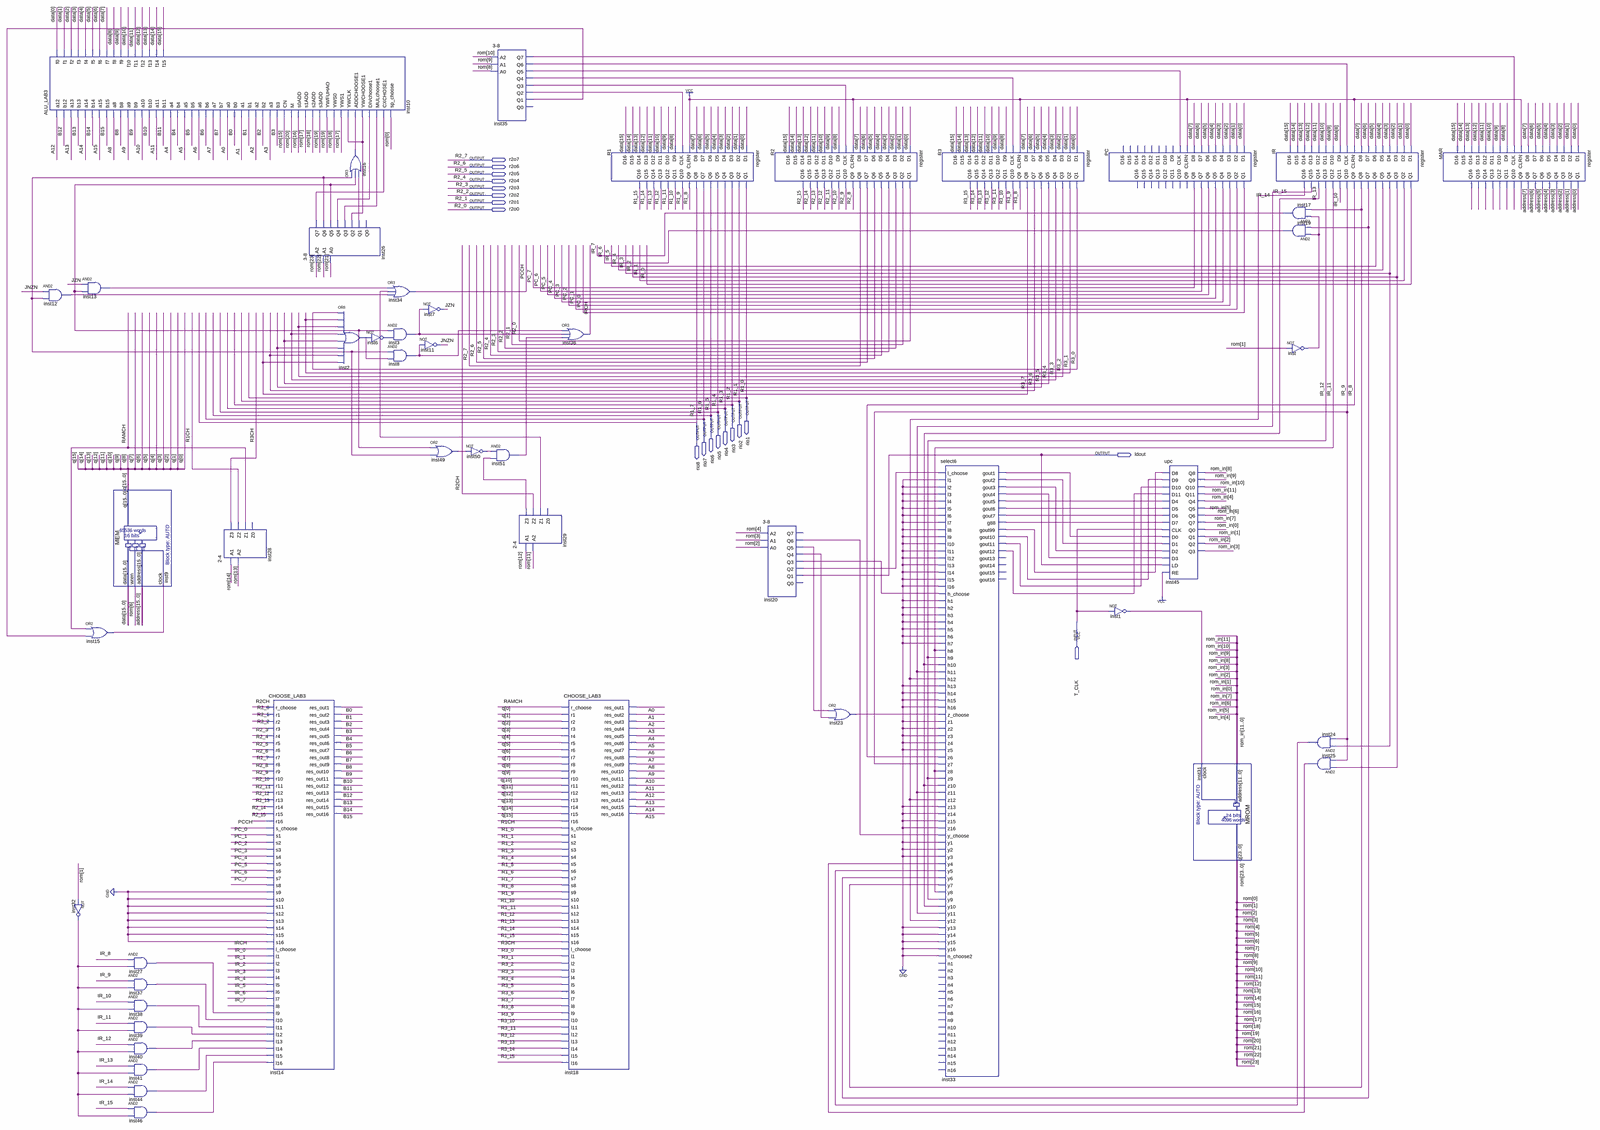
[diagram p0: schematic sheet, whole]
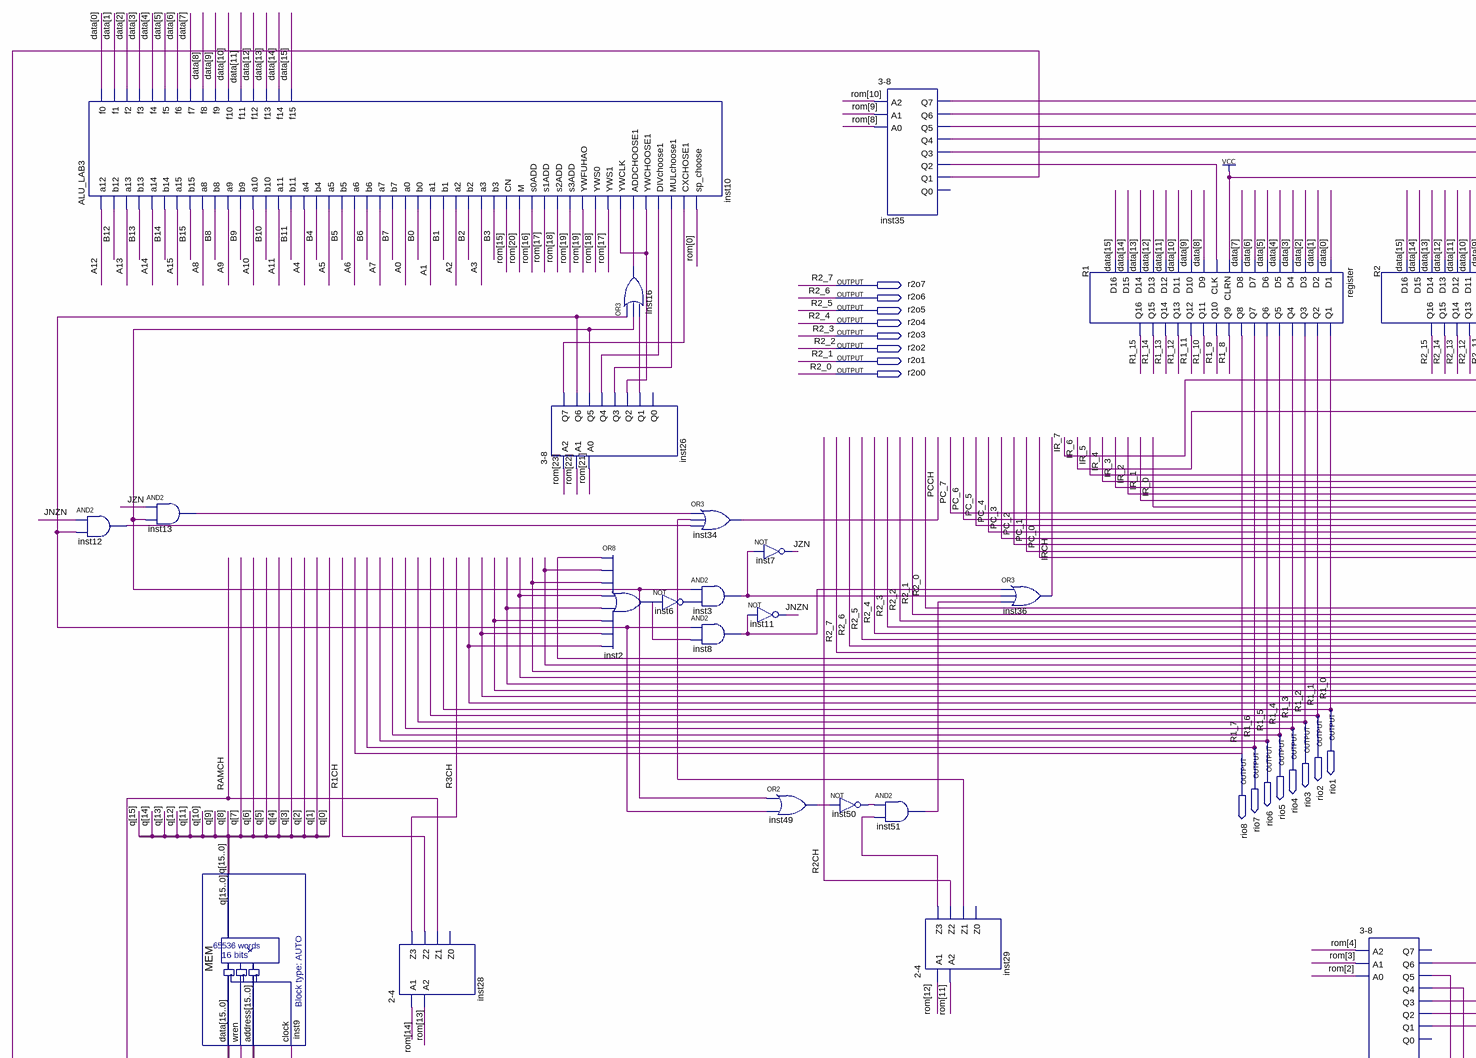
[diagram p1: schematic sheet, upper left part]
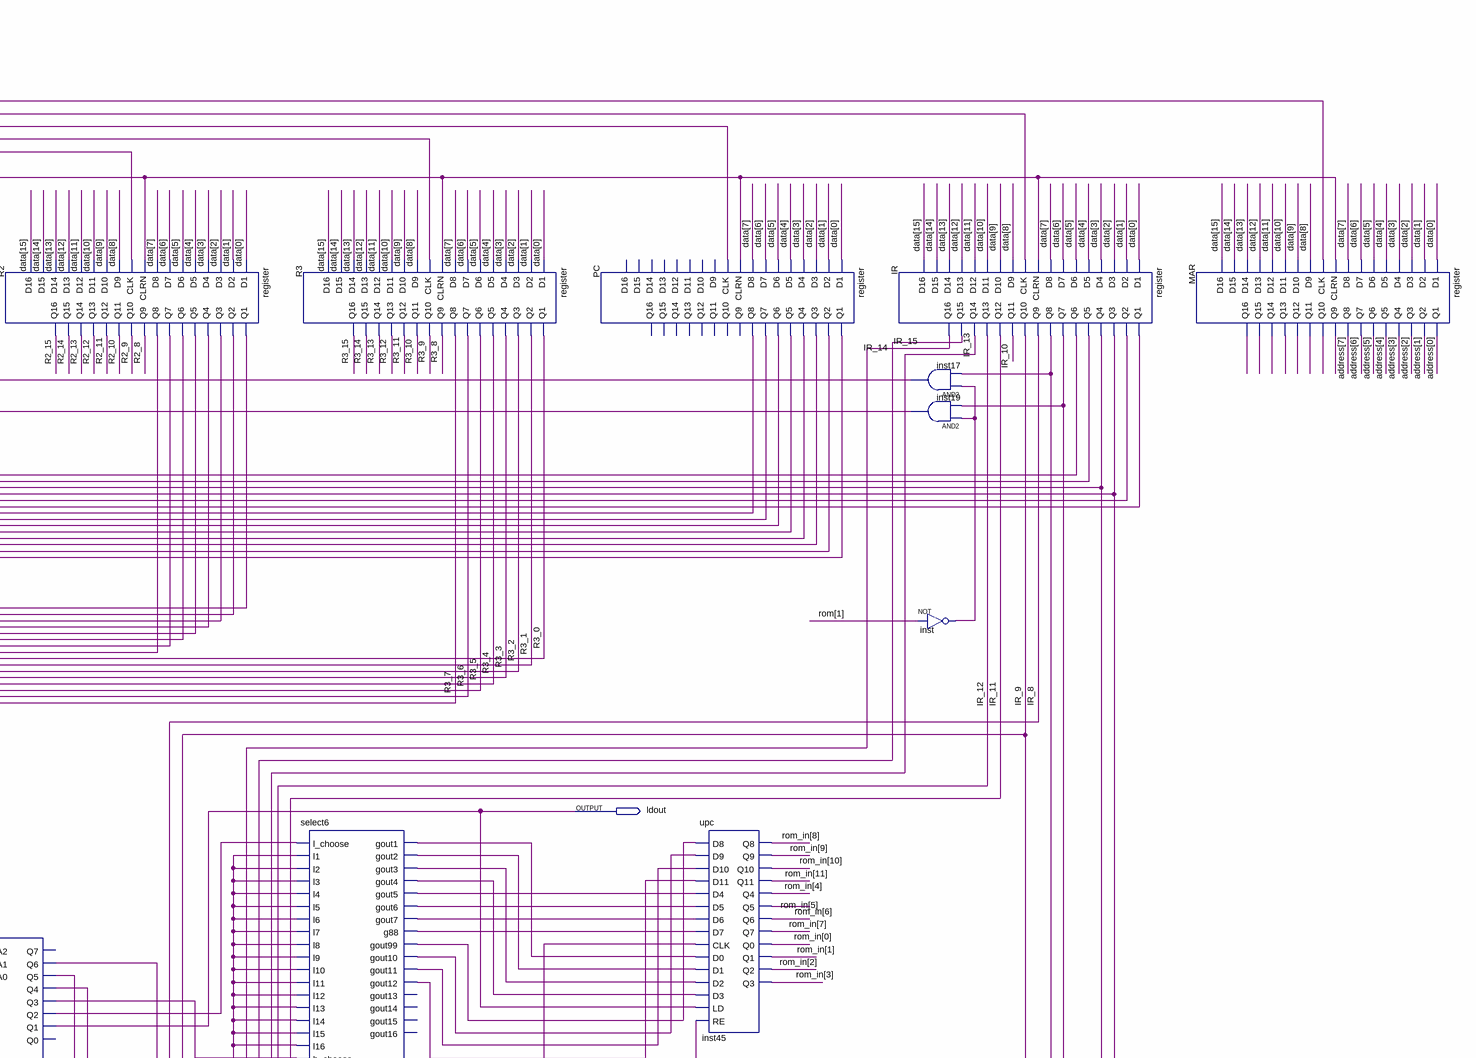
[diagram p2: schematic sheet, upper right part]
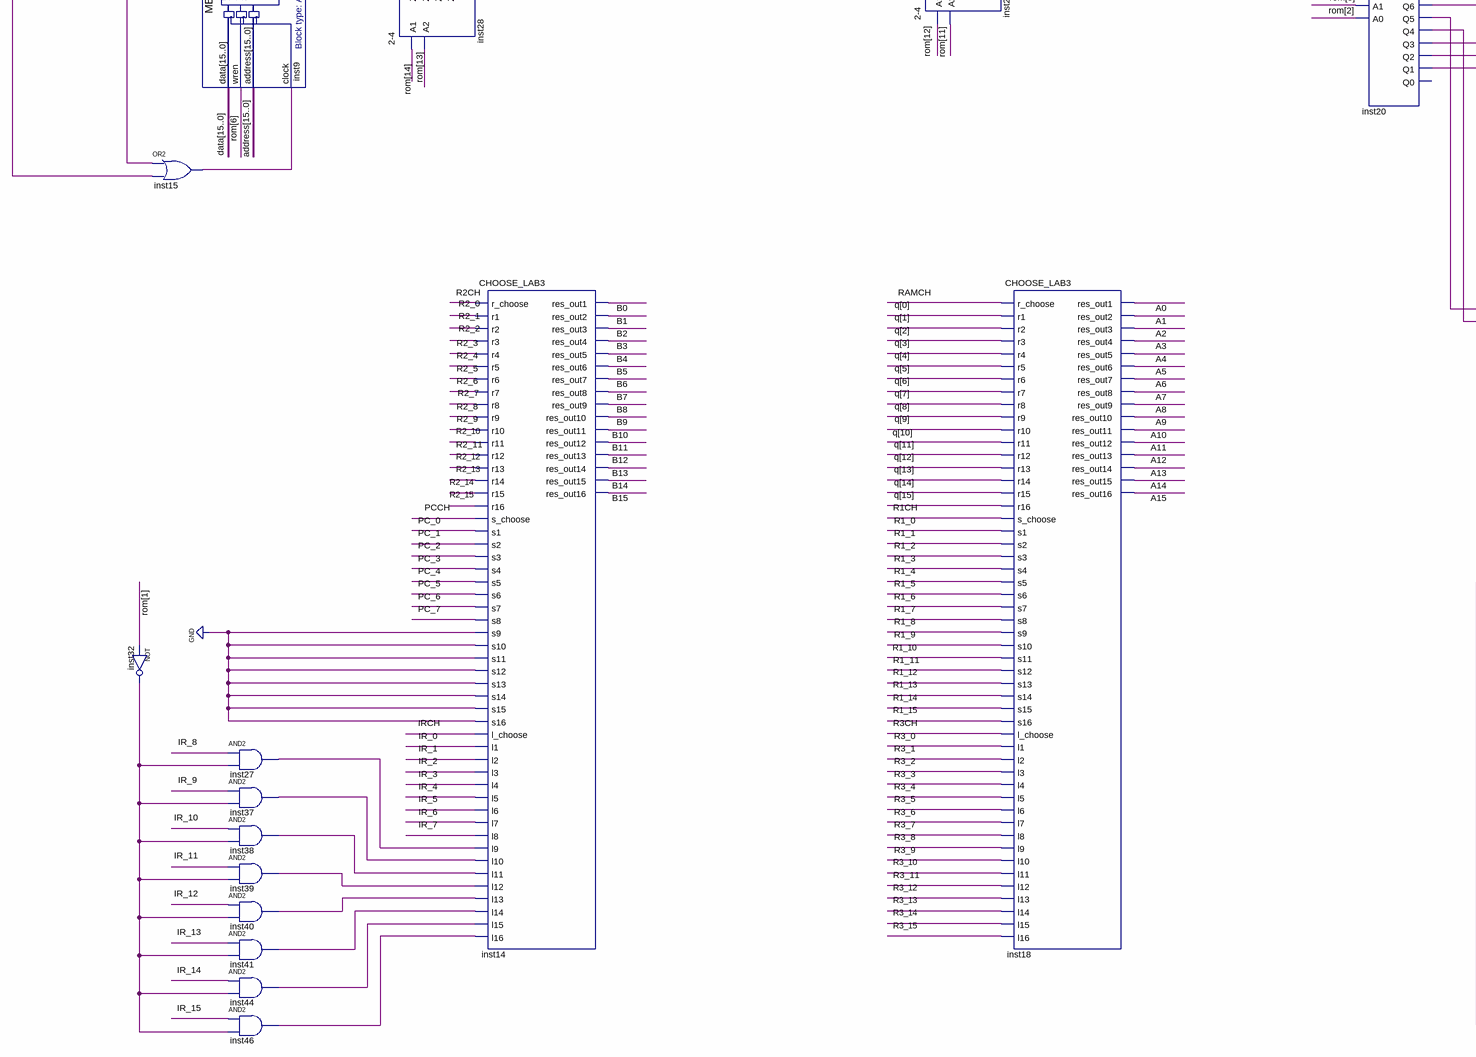
[diagram p3: schematic sheet, lower left part]
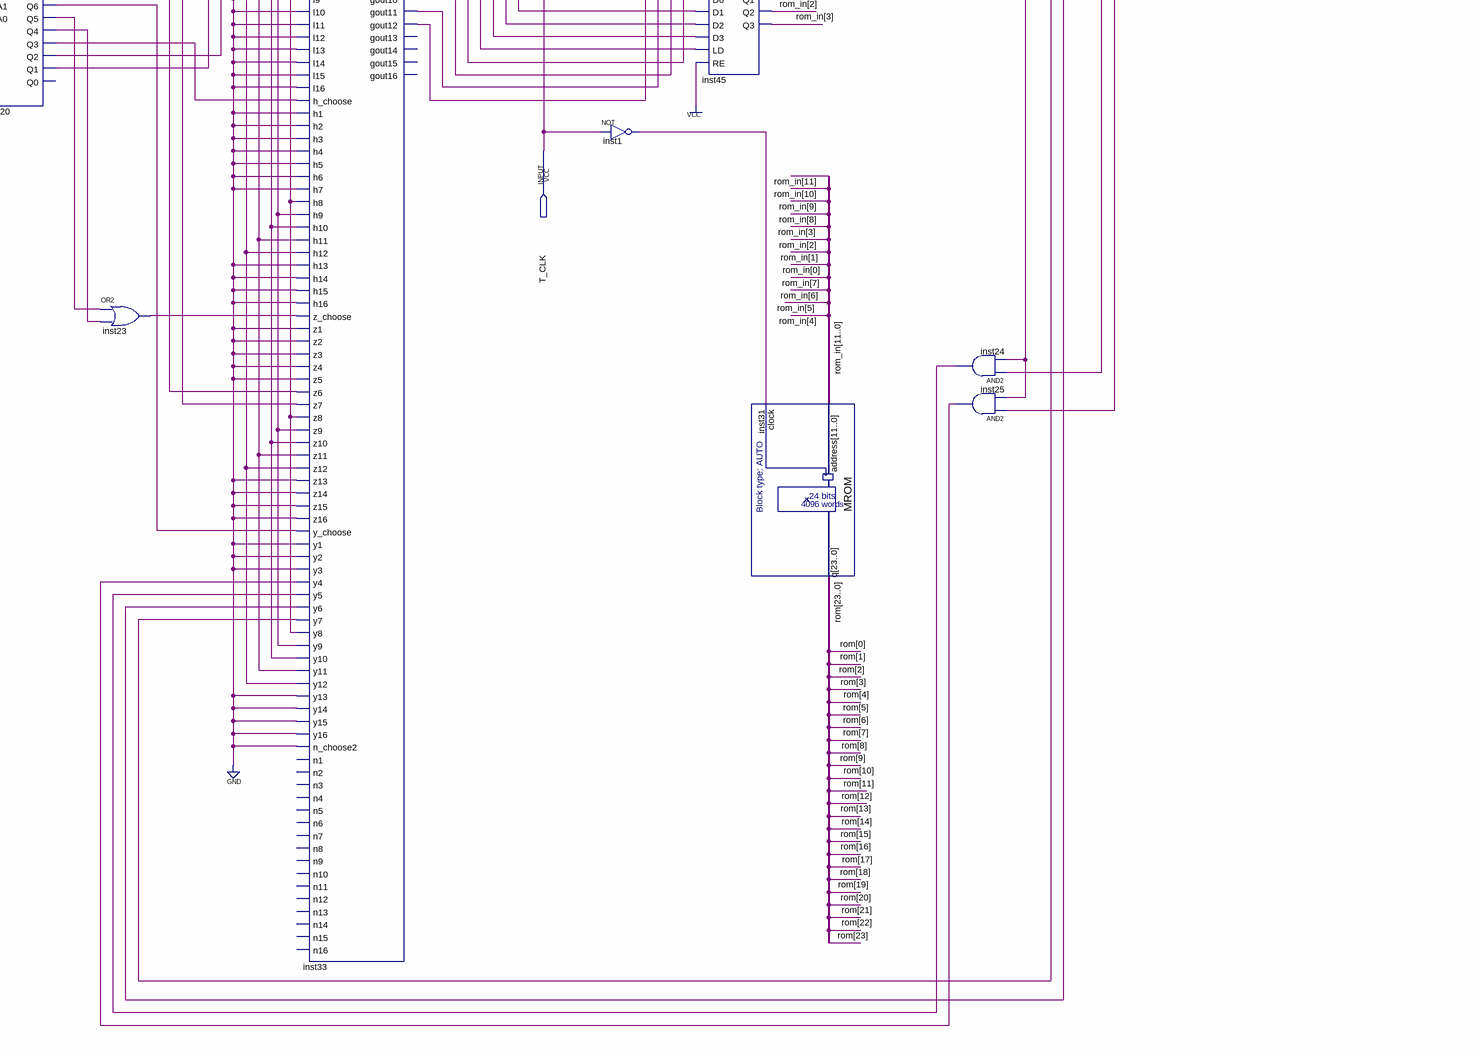
[diagram p4: schematic sheet, lower right part]
// Quartus schematic lab31119.bdf as structural Verilog: 49 symbols, 18 pins
module lab31119 (
  input  T_CLK,
  output r2o7,
  output r2o6,
  output r2o5,
  output r2o4,
  output r2o3,
  output r2o2,
  output r2o1,
  output r2o0,
  output rio1,
  output rio2,
  output rio3,
  output rio4,
  output rio5,
  output rio6,
  output rio7,
  output rio8,
  output ldout
);

  wire A0, A1, A2, A3, A4, A5, A6, A7, A8, A9, A10, A11, A12, A13, A14, A15, B0, B1, B2, B3, B4, B5, B6, B7,
       B8, B9, B10, B11, B12, B13, B14, B15, inst1_out, inst2_out, inst3_out, inst6_out, inst8_out,
       inst12_out, inst13_out, inst15_out, inst16_out, inst20_q2, inst20_q3, inst20_q4, inst20_q5, inst20_q6,
       inst23_out, inst24_out, inst25_out, inst26_q1, inst26_q2, inst26_q3, inst26_q4, inst26_q5, inst26_q6,
       inst26_q7, inst27_out, inst29_z1, inst29_z3, inst32_out, inst33_g88, inst33_gout1, inst33_gout2,
       inst33_gout3, inst33_gout4, inst33_gout5, inst33_gout6, inst33_gout7, inst33_gout10, inst33_gout11,
       inst33_gout12, inst33_gout99, inst35_q1, inst35_q2, inst35_q3, inst35_q4, inst35_q5, inst35_q6,
       inst35_q7, inst37_out, inst38_out, inst39_out, inst40_out, inst41_out, inst44_out, inst46_out,
       inst49_out, inst50_out, inst51_out, inst_out, IR_0, IR_1, IR_2, IR_3, IR_4, IR_5, IR_6, IR_7, IR_8,
       IR_9, IR_10, IR_11, IR_12, IR_13, IR_14, IR_15, IR_q7, IR_q8, IRCH, JNZN, JZN, MAR_q9, MAR_q10,
       MAR_q11, MAR_q12, MAR_q13, MAR_q14, MAR_q15, MAR_q16, PC_0, PC_1, PC_2, PC_3, PC_4, PC_5, PC_6, PC_7,
       PCCH, R1_8, R1_9, R1_10, R1_11, R1_12, R1_13, R1_14, R1_15, R1CH, R2_8, R2_9, R2_10, R2_11, R2_12,
       R2_13, R2_14, R2_15, R2CH, R3_0, R3_1, R3_2, R3_3, R3_4, R3_5, R3_6, R3_7, R3_8, R3_9, R3_10, R3_11,
       R3_12, R3_13, R3_14, R3_15, R3CH, RAMCH;
  wire [11:0] rom_in;
  wire [15:0] address, data, q;
  wire [23:0] rom;

  ALU_LAB3 inst10 (
    .a12(A12), .b12(B12), .a13(A13), .b13(B13), .a14(A14), .b14(B14), .a15(A15), .b15(B15), .a8(A8), .b8(B8),
    .a9(A9), .b9(B9), .a10(A10), .b10(B10), .a11(A11), .b11(B11), .a4(A4), .b4(B4), .a5(A5), .b5(B5),
    .a6(A6), .b6(B6), .a7(A7), .b7(B7), .a0(A0), .b0(B0), .a1(A1), .b1(B1), .a2(A2), .b2(B2), .a3(A3),
    .b3(B3), .CN(rom[15]), .M(rom[20]), .s0ADD(rom[16]), .s1ADD(rom[17]), .s2ADD(rom[18]), .s3ADD(rom[19]),
    .YWFUHAO(rom[19]), .YWS0(rom[18]), .YWS1(rom[17]), .YWCLK(inst26_q2), .ADDCHOOSE1(inst16_out),
    .YWCHOOSE1(inst26_q2), .DIVchoose1(inst26_q4), .MULchoose1(inst26_q3), .CXCHOSE1(inst26_q7),
    .sp_choose(rom[0]), .f0(data[0]), .f1(data[1]), .f2(data[2]), .f3(data[3]), .f4(data[4]), .f5(data[5]),
    .f6(data[6]), .f7(data[7]), .f8(data[8]), .f9(data[9]), .f10(data[10]), .f11(data[11]), .f12(data[12]),
    .f13(data[13]), .f14(data[14]), .f15(data[15]));
  and inst12 (inst12_out, JNZN, inst26_q6);
  not inst32 (inst32_out, rom[1]);
  and inst13 (inst13_out, JZN, inst26_q5);
  or inst15 (inst15_out, RAMCH, inst35_q1);
  MEM inst9 (.data(data), .wren(rom[6]), .address(address), .clock(inst15_out), .q(q));
  and inst27 (inst27_out, IR_8, inst32_out);
  and inst37 (inst37_out, IR_9, inst32_out);
  and inst38 (inst38_out, IR_10, inst32_out);
  and inst39 (inst39_out, IR_11, inst32_out);
  and inst40 (inst40_out, IR_12, inst32_out);
  and inst41 (inst41_out, IR_13, inst32_out);
  and inst44 (inst44_out, IR_14, inst32_out);
  and inst46 (inst46_out, IR_15, inst32_out);
  \2-4  inst28 (.A1(rom[14]), .A2(rom[13]), .Z3(R3CH), .Z2(R1CH), .Z1(RAMCH));  // open: Z0
  CHOOSE_LAB3 inst14 (
    .r_choose(R2CH), .r1(r2o0), .r2(r2o1), .r3(r2o2), .r4(r2o3), .r5(r2o4), .r6(r2o5), .r7(r2o6), .r8(r2o7),
    .r9(R2_8), .r10(R2_9), .r11(R2_10), .r12(R2_11), .r13(R2_12), .r14(R2_13), .r15(R2_14), .r16(R2_15),
    .s_choose(PCCH), .s1(PC_0), .s2(PC_1), .s3(PC_2), .s4(PC_3), .s5(PC_4), .s6(PC_5), .s7(PC_6), .s8(PC_7),
    .s9(1'b0), .s10(1'b0), .s11(1'b0), .s12(1'b0), .s13(1'b0), .s14(1'b0), .s15(1'b0), .s16(1'b0),
    .l_choose(IRCH), .l1(IR_0), .l2(IR_1), .l3(IR_2), .l4(IR_3), .l5(IR_4), .l6(IR_5), .l7(IR_6), .l8(IR_7),
    .l9(inst27_out), .l10(inst37_out), .l11(inst38_out), .l12(inst39_out), .l13(inst40_out),
    .l14(inst41_out), .l15(inst44_out), .l16(inst46_out), .res_out1(B0), .res_out2(B1), .res_out3(B2),
    .res_out4(B3), .res_out5(B4), .res_out6(B5), .res_out7(B6), .res_out8(B7), .res_out9(B8), .res_out10(B9),
    .res_out11(B10), .res_out12(B11), .res_out13(B12), .res_out14(B13), .res_out15(B14), .res_out16(B15));
  \3-8  inst26 (
    .A2(rom[23]), .A1(rom[22]), .A0(rom[21]), .Q7(inst26_q7), .Q6(inst26_q6), .Q5(inst26_q5), .Q4(inst26_q4),
    .Q3(inst26_q3), .Q2(inst26_q2), .Q1(inst26_q1));  // open: Q0
  or inst16 (inst16_out, inst26_q6, inst26_q5, inst26_q1);
  or inst2 (inst2_out, R3_0, R3_1, R3_2, R3_3, R3_4, R3_5, R3_6, R3_7);
  or inst34 (PCCH, inst13_out, inst29_z1, inst12_out);
  and inst3 (inst3_out, inst26_q5, inst6_out);
  not inst6 (inst6_out, inst2_out);
  and inst8 (inst8_out, inst26_q6, inst2_out);
  not inst7 (JZN, inst3_out);
  not inst11 (JNZN, inst8_out);
  or inst49 (inst49_out, inst26_q5, inst26_q6);
  not inst50 (inst50_out, inst49_out);
  \3-8  inst35 (
    .A2(rom[10]), .A1(rom[9]), .A0(rom[8]), .Q7(inst35_q7), .Q6(inst35_q6), .Q5(inst35_q5), .Q4(inst35_q4),
    .Q3(inst35_q3), .Q2(inst35_q2), .Q1(inst35_q1));  // open: Q0
  and inst51 (inst51_out, inst50_out, inst29_z3);
  \2-4  inst29 (.A1(rom[12]), .A2(rom[11]), .Z3(inst29_z3), .Z2(R2CH), .Z1(inst29_z1));  // open: Z0
  or inst36 (IRCH, inst8_out, inst3_out, inst51_out);
  CHOOSE_LAB3 inst18 (
    .r_choose(RAMCH), .r1(q[0]), .r2(q[1]), .r3(q[2]), .r4(q[3]), .r5(q[4]), .r6(q[5]), .r7(q[6]), .r8(q[7]),
    .r9(q[8]), .r10(q[9]), .r11(q[10]), .r12(q[11]), .r13(q[12]), .r14(q[13]), .r15(q[14]), .r16(q[15]),
    .s_choose(R1CH), .s1(rio1), .s2(rio2), .s3(rio3), .s4(rio4), .s5(rio5), .s6(rio6), .s7(rio7), .s8(rio8),
    .s9(R1_8), .s10(R1_9), .s11(R1_10), .s12(R1_11), .s13(R1_12), .s14(R1_13), .s15(R1_14), .s16(R1_15),
    .l_choose(R3CH), .l1(R3_0), .l2(R3_1), .l3(R3_2), .l4(R3_3), .l5(R3_4), .l6(R3_5), .l7(R3_6), .l8(R3_7),
    .l9(R3_8), .l10(R3_9), .l11(R3_10), .l12(R3_11), .l13(R3_12), .l14(R3_13), .l15(R3_14), .l16(R3_15),
    .res_out1(A0), .res_out2(A1), .res_out3(A2), .res_out4(A3), .res_out5(A4), .res_out6(A5), .res_out7(A6),
    .res_out8(A7), .res_out9(A8), .res_out10(A9), .res_out11(A10), .res_out12(A11), .res_out13(A12),
    .res_out14(A13), .res_out15(A14), .res_out16(A15));
  register R1 (
    .D1(data[0]), .D2(data[1]), .D3(data[2]), .D4(data[3]), .D5(data[4]), .D6(data[5]), .D7(data[6]),
    .D8(data[7]), .CLRN(1'b1), .CLK(inst35_q2), .D9(data[8]), .D10(data[9]), .D11(data[10]), .D12(data[11]),
    .D13(data[12]), .D14(data[13]), .D15(data[14]), .D16(data[15]), .Q1(rio1), .Q2(rio2), .Q3(rio3),
    .Q4(rio4), .Q5(rio5), .Q6(rio6), .Q7(rio7), .Q8(rio8), .Q9(R1_8), .Q10(R1_9), .Q11(R1_10), .Q12(R1_11),
    .Q13(R1_12), .Q14(R1_13), .Q15(R1_14), .Q16(R1_15));
  register R2 (
    .D1(data[0]), .D2(data[1]), .D3(data[2]), .D4(data[3]), .D5(data[4]), .D6(data[5]), .D7(data[6]),
    .D8(data[7]), .CLRN(1'b1), .CLK(inst35_q3), .D9(data[8]), .D10(data[9]), .D11(data[10]), .D12(data[11]),
    .D13(data[12]), .D14(data[13]), .D15(data[14]), .D16(data[15]), .Q1(r2o0), .Q2(r2o1), .Q3(r2o2),
    .Q4(r2o3), .Q5(r2o4), .Q6(r2o5), .Q7(r2o6), .Q8(r2o7), .Q9(R2_8), .Q10(R2_9), .Q11(R2_10), .Q12(R2_11),
    .Q13(R2_12), .Q14(R2_13), .Q15(R2_14), .Q16(R2_15));
  \3-8  inst20 (
    .A2(rom[4]), .A1(rom[3]), .A0(rom[2]), .Q6(inst20_q6), .Q5(inst20_q5), .Q4(inst20_q4), .Q3(inst20_q3),
    .Q2(inst20_q2), .Q1(ldout));  // open: Q7, Q0
  or inst23 (inst23_out, inst20_q5, inst20_q4);
  register R3 (
    .D1(data[0]), .D2(data[1]), .D3(data[2]), .D4(data[3]), .D5(data[4]), .D6(data[5]), .D7(data[6]),
    .D8(data[7]), .CLRN(1'b1), .CLK(inst35_q4), .D9(data[8]), .D10(data[9]), .D11(data[10]), .D12(data[11]),
    .D13(data[12]), .D14(data[13]), .D15(data[14]), .D16(data[15]), .Q1(R3_0), .Q2(R3_1), .Q3(R3_2),
    .Q4(R3_3), .Q5(R3_4), .Q6(R3_5), .Q7(R3_6), .Q8(R3_7), .Q9(R3_8), .Q10(R3_9), .Q11(R3_10), .Q12(R3_11),
    .Q13(R3_12), .Q14(R3_13), .Q15(R3_14), .Q16(R3_15));
  select6 inst33 (
    .l_choose(inst20_q2), .l1(1'b0), .l2(1'b0), .l3(1'b0), .l4(1'b0), .l5(1'b0), .l6(1'b0), .l7(1'b0),
    .l8(1'b0), .l9(1'b0), .l10(1'b0), .l11(1'b0), .l12(1'b0), .l13(1'b0), .l14(1'b0), .l15(1'b0), .l16(1'b0),
    .h_choose(inst20_q3), .h1(1'b0), .h2(1'b0), .h3(1'b0), .h4(1'b0), .h5(1'b0), .h6(1'b0), .h7(1'b0),
    .h8(IR_11), .h9(IR_12), .h10(IR_13), .h11(IR_14), .h12(IR_15), .h13(1'b0), .h14(1'b0), .h15(1'b0),
    .h16(1'b0), .z_choose(inst23_out), .z1(1'b0), .z2(1'b0), .z3(1'b0), .z4(1'b0), .z5(1'b0), .z6(IR_8),
    .z7(IR_9), .z8(IR_11), .z9(IR_12), .z10(IR_13), .z11(IR_14), .z12(IR_15), .z13(1'b0), .z14(1'b0),
    .z15(1'b0), .z16(1'b0), .y_choose(inst20_q6), .y1(1'b0), .y2(1'b0), .y3(1'b0), .y4(inst25_out),
    .y5(inst24_out), .y6(IR_q7), .y7(IR_q8), .y8(IR_11), .y9(IR_12), .y10(IR_13), .y11(IR_14), .y12(IR_15),
    .y13(1'b0), .y14(1'b0), .y15(1'b0), .y16(1'b0), .n_choose2(1'b0), .gout1(inst33_gout1),
    .gout2(inst33_gout2), .gout3(inst33_gout3), .gout4(inst33_gout4), .gout5(inst33_gout5),
    .gout6(inst33_gout6), .gout7(inst33_gout7), .g88(inst33_g88), .gout99(inst33_gout99),
    .gout10(inst33_gout10), .gout11(inst33_gout11), .gout12(inst33_gout12));  // open: n1, n2, n3, n4, n5, n6, n7, n8, n9, n10, n11, n12, n13, n14, n15, n16, gout13, gout14, gout15, gout16
  register PC (
    .D1(data[0]), .D2(data[1]), .D3(data[2]), .D4(data[3]), .D5(data[4]), .D6(data[5]), .D7(data[6]),
    .D8(data[7]), .CLRN(1'b1), .CLK(inst35_q5), .Q1(PC_0), .Q2(PC_1), .Q3(PC_2), .Q4(PC_3), .Q5(PC_4),
    .Q6(PC_5), .Q7(PC_6), .Q8(PC_7));  // open: D9, D10, D11, D12, D13, D14, D15, D16, Q9, Q10, Q11, Q12, Q13, Q14, Q15, Q16
  not inst1 (inst1_out, T_CLK);
  upc inst45 (
    .D8(inst33_gout99), .D9(inst33_gout10), .D10(inst33_gout11), .D11(inst33_gout12), .D4(inst33_gout5),
    .D5(inst33_gout6), .D6(inst33_gout7), .D7(inst33_g88), .CLK(T_CLK), .D0(inst33_gout1), .D1(inst33_gout2),
    .D2(inst33_gout3), .D3(inst33_gout4), .LD(ldout), .RE(1'b1), .Q8(rom_in[8]), .Q9(rom_in[9]),
    .Q10(rom_in[10]), .Q11(rom_in[11]), .Q4(rom_in[4]), .Q5(rom_in[5]), .Q6(rom_in[6]), .Q7(rom_in[7]),
    .Q0(rom_in[0]), .Q1(rom_in[1]), .Q2(rom_in[2]), .Q3(rom_in[3]));
  MROM inst31 (.address(rom_in), .clock(inst1_out), .q(rom));
  register IR (
    .D1(data[0]), .D2(data[1]), .D3(data[2]), .D4(data[3]), .D5(data[4]), .D6(data[5]), .D7(data[6]),
    .D8(data[7]), .CLRN(1'b1), .CLK(inst35_q6), .D9(data[8]), .D10(data[9]), .D11(data[10]), .D12(data[11]),
    .D13(data[12]), .D14(data[13]), .D15(data[14]), .D16(data[15]), .Q1(IR_0), .Q2(IR_1), .Q3(IR_2),
    .Q4(IR_3), .Q5(IR_4), .Q6(IR_5), .Q7(IR_q7), .Q8(IR_q8), .Q9(IR_8), .Q10(IR_9), .Q11(IR_10), .Q12(IR_11),
    .Q13(IR_12), .Q14(IR_13), .Q15(IR_14), .Q16(IR_15));
  and inst17 (IR_7, inst_out, IR_q8);
  and inst19 (IR_6, inst_out, IR_q7);
  not inst (inst_out, rom[1]);
  and inst24 (inst24_out, IR_3, IR_9);
  and inst25 (inst25_out, IR_2, IR_9);
  register MAR (
    .D1(data[0]), .D2(data[1]), .D3(data[2]), .D4(data[3]), .D5(data[4]), .D6(data[5]), .D7(data[6]),
    .D8(data[7]), .CLRN(1'b1), .CLK(inst35_q7), .D9(data[8]), .D10(data[9]), .D11(data[10]), .D12(data[11]),
    .D13(data[12]), .D14(data[13]), .D15(data[14]), .D16(data[15]), .Q1(address[0]), .Q2(address[1]),
    .Q3(address[2]), .Q4(address[3]), .Q5(address[4]), .Q6(address[5]), .Q7(address[6]), .Q8(address[7]),
    .Q9(MAR_q9), .Q10(MAR_q10), .Q11(MAR_q11), .Q12(MAR_q12), .Q13(MAR_q13), .Q14(MAR_q14), .Q15(MAR_q15),
    .Q16(MAR_q16));

  // Other names for the same wires on the sheet: R2_0 = r2o0; R2_1 = r2o1; R2_2 = r2o2; R2_3 = r2o3; R2_4 = r2o4;
  //   R2_5 = r2o5; R2_6 = r2o6; R2_7 = r2o7; R1_0 = rio1; R1_1 = rio2; R1_2 = rio3; R1_3 = rio4; R1_4 = rio5;
  //   R1_5 = rio6; R1_6 = rio7; R1_7 = rio8
endmodule
